# Altium schematic sheet OSC.SchDoc
size A3; SheetNumber: 1; SheetTotal: 1
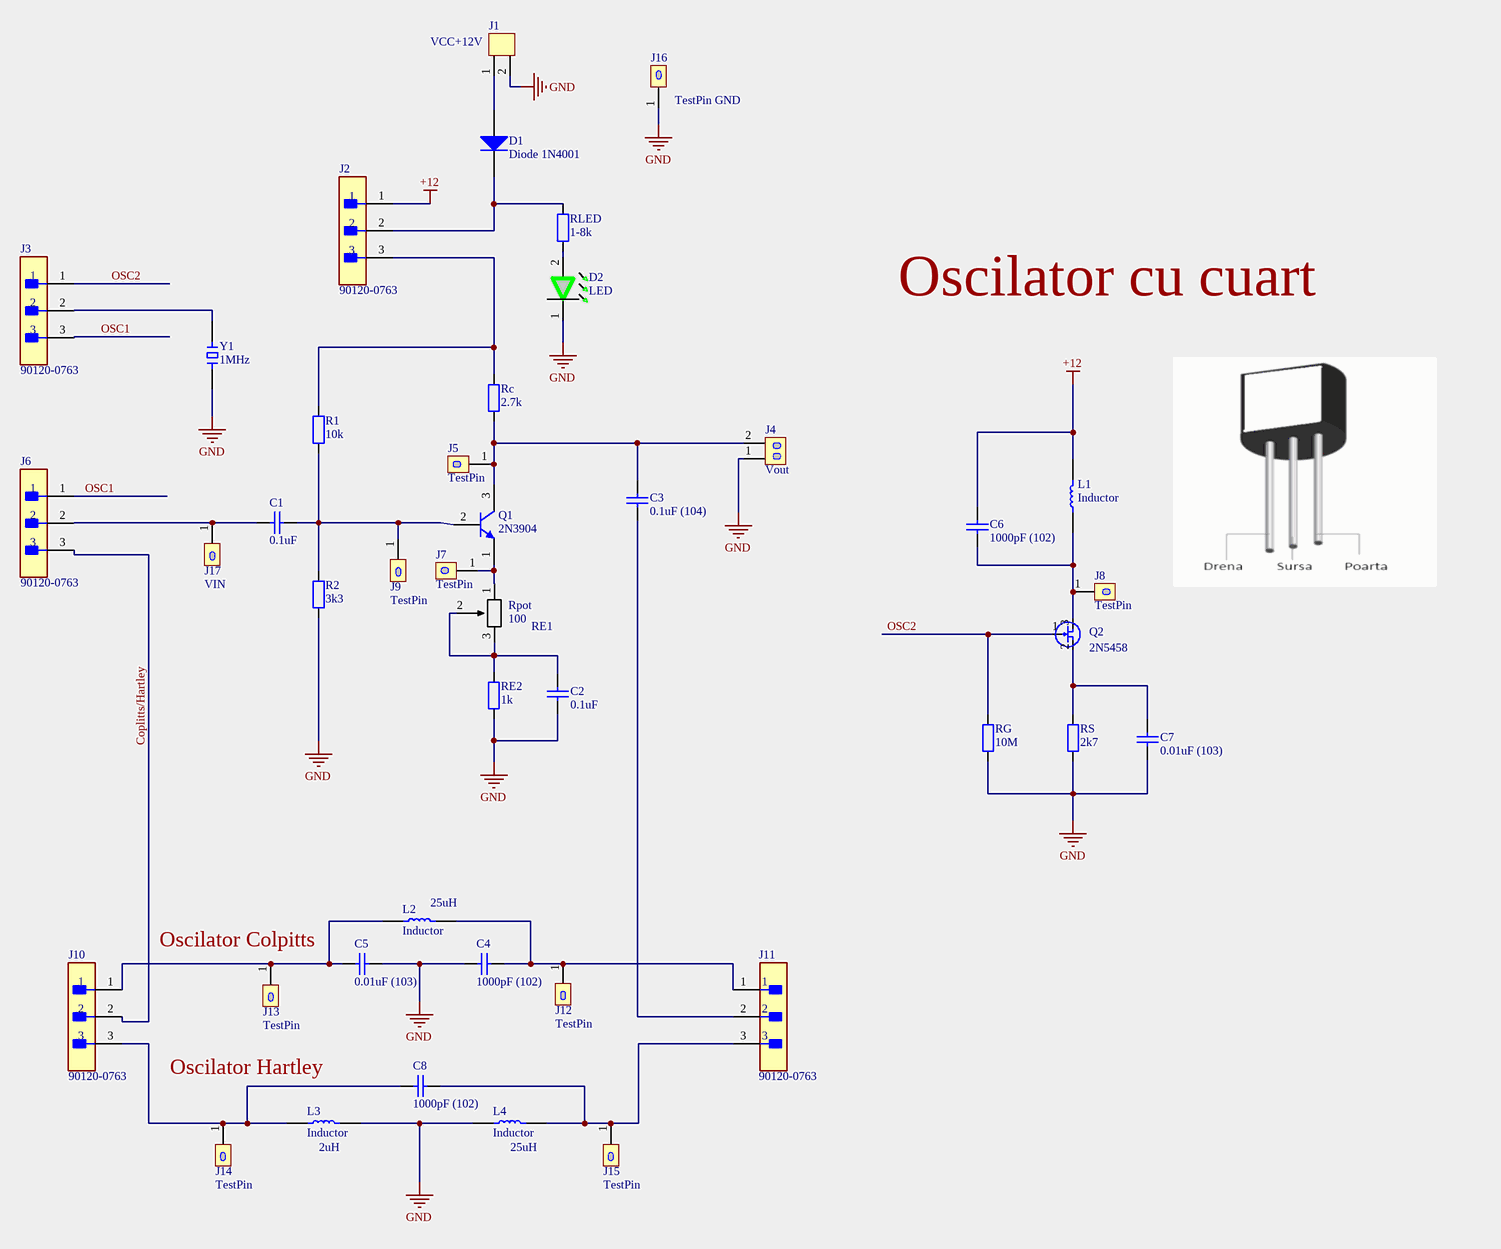
[diagram p0: OSC.SchDoc]

## Parts
C1  0.1uF  [CAP4.5mm]
C2  0.1uF  [CAP4.5mm]
C3  0.1uF (104)  [CAP4.5mm]
C4  1000pF (102)  [CAP4.5mm]
C5  0.01uF (103)  [CAP4.5mm]
C6  1000pF (102)  [CAP4.5mm]
C7  0.01uF (103)  [CAP4.5mm]
C8  1000pF (102)  [CAP4.5mm]
D1  Diode 1N4001  [DO-41]
D2  LED  [LED]
J1  VCC+12V  [HDR_1X2_TE]
J2  90120-0763  [FP-90120-0763-MFG]
J3  90120-0763  [FP-90120-0763-MFG]
J4  Vout  [HDR_1x2_pin]
J5  TestPin  [HDR_1x1_pin]
J6  90120-0763  [FP-90120-0763-MFG]
J7  TestPin  [HDR_1x1_pin]
J8  TestPin  [HDR_1x1_pin]
J9  TestPin  [HDR_1x1_pin]
J10  90120-0763  [FP-90120-0763-MFG]
J11  90120-0763  [FP-90120-0763-MFG]
J12  TestPin  [HDR_1x1_pin]
J13  TestPin  [HDR_1x1_pin]
J14  TestPin  [HDR_1x1_pin]
J15  TestPin  [HDR_1x1_pin]
J16  TestPin GND  [HDR_1x1_pin]
J17  VIN  [HDR_1x1_pin]
L1  Inductor  [Inductor1]
L2  Inductor  [Inductor1]
L3  Inductor  [Inductor1]
L4  Inductor  [Inductor1]
Q1  2N3904  [ONSC-TO-92-3-29-11]
Q2  2N5458  [2N5458]
R1  10k  [Resistor]
R2  3k3  [Resistor]
Rc  2.7k  [Resistor]
RE1  Rpot100ohm  [Potentiometer]  (value not drawn)
RE2  1k  [Resistor]
RG  10M  [Resistor]
RLED  1-8k  [Resistor]
RS  2k7  [Resistor]
Y1  1MHz  [XTAL]

## Nets
+12: C6.2 J2.1 L1.1
GND: C2.2 C4.1 C5.2 C7.1 D2.1 J1.2 J4.1 J16.1 L3.1 L4.2 R2.1 RE2.1 RG.1 RS.1 Y1.1
Coplitts/Hartley: J6.3 J10.2
OSC1: J3.3 J6.1
OSC2: J3.1 Q2.1 RG.2
NetC1_1: C1.1 J6.2 J17.1
NetC1_2: C1.2 J9.1 Q1.2(B) R1.1 R2.2
NetC2_1: C2.1 RE1.2 RE1.3 RE2.2
NetC3_1: C3.1 J4.2 J5.1 Q1.3(C) Rc.1
NetC3_2: C3.2 J11.2
NetC4_2: C4.2 J11.1 J12.1 L2.1
NetC5_1: C5.1 J10.1 J13.1 L2.2
NetC6_1: C6.1 J8.1 L1.2 Q2.3(D)
NetC7_2: C7.2 Q2.2(S) RS.2
NetC8_1: C8.1 J10.3 J14.1 L3.2
NetC8_2: C8.2 J11.3 J15.1 L4.1
NetD1_1: D1.1(A) J1.1
NetD1_2: D1.2(K) J2.2 RLED.2
NetD2_2: D2.2 RLED.1
NetJ2_3: J2.3 R1.2 Rc.2
NetJ3_2: J3.2 Y1.2
NetJ7_1: J7.1 Q1.1(E) RE1.1

## Notes on the sheet
- Oscilator cu cuart
- (near C5) Oscilator Colpitts
- (near L2) 25uH
- Oscilator Hartley
- (near L3) 2uH
- (near L4) 25uH
- (in symbol Rpot) 100

## Library data of the parts
C1-C8 = CAP 104: 104 cap
D1 = Diode 1N4001: 1 Amp General Purpose Rectifier; Published: 8-Jun-2000; LatestRevisionDate: 17-Jul-2002; LatestRevisionNote: Re-released for DXP Platform.; DatasheetVersion: 1998; PackageVersion: Aug-1999; PackageReference: DO-41; Publisher: Altium Limited; PackageDescription: Diode, Axial; Body 5.2 x 2.7 mm (LxDia. max), Lead Dia. 0.86 mm (max); Code_JEDEC: DO-204-AL; ComponentLink1Description: Manufacturer Link; ComponentLink1URL: http://www.fairchildsemi.com/; ComponentLink2Description: Datasheet; ComponentLink2URL: http://www.fairchildsemi.com/ds/1N%2F1N4001.pdf
J1 = CON_1x2: Connector, 2-Ports
J2 J3 J6 J10 J11 = CMP-04776-000084-1: CONN HEADER VERT 3POS 2.54MM; Manufacturer: Molex; Voltage Rating: 350V; Number Of Contacts: 3; Conn Orientation: Vertical; Current Rating: 3A; Conn Gender: Male; Package: 90120-0763; ComponentLink2Description: Datasheet; Height: 5.8mm; Manufacturer Part Number: 90120-0763; Temperature Range High: +125°C; RoHS: TRUE; ComponentLink2URL: https://www.molex.com/webdocs/datasheets/pdf/en-us/0901200763_PCB_HEADERS.pdf; Device Class L2: Headers and Wire Housings; Temperature: -55°C to +125°C; Device Class L1: Connectors; Pitch: 2.54mm; Footprint Url: https://www.molex.com/pdm_docs/sd/901200763_sd.pdf; Device Class L3: unset; Temperature Range Low: -55°C; Number Of Rows: 1; Category: Conn; Lead Free: Yes; Mouser Description: Board-To-Board Connector, C-Grid III 90120 Series, Through Hole, Header, 3, 2.54 mm; Octopart: https://octopart.com/90120-0763-molex-655433; Contact Material: Gold,Nickel; Automotive: No; Digikey Description: CONN HEADER VERT 3POS 2.54MM
J4 = HDR_1x2: Header, 2-Pin
J5 J7-J9 J12-J17 = Test Pin
Q1 = CMP-2000-05562-1: General Purpose Transistor, NPN Silicon, 200 mA, 60 V, -55 to 150 degC, 3-Pin TO-92, RoHS, Bulk; Manufacturer: ONSemiconductor; Emitter- Base Voltage VEBO: 6V; Maximum Power Dissipation: 625mW; Maximum DC Collector Current: 0.2A; Collector- Emitter Voltage VCEO Max: 40V; Collector- Base Voltage VCBO: 60V; DC Collector/Base Gain hfe Min: 60; Configuration: Single; Collector-Emitter Saturation Voltage: 0.3V; Gain Bandwidth Product fT: 270MHz; Mounting Style: ThroughHole; Package / Case: TO-92-3(TO-226); Mounting Technology: ThroughHole; Minimum Operating Temperature: -65C; Datasheet Version: Rev. 8, 08/2012; Product Category: BipolarTransistors-BJT; Factory Pack Quantity: 5000; Transistor Polarity: NPN; Package Description: 3-Pin Transistor Outline, Body 4.825 x 3.685 mm, Pitch 1.27 mm; RoHS: Details; Datasheet URL: https://datasheet.ciiva.com/4725/2n3903-d-285841-4725808.pdf; Packaging: Bulk; Maximum Operating Temperature: +150C; Package Reference: TO-92-3-29-11; Brand: ONSemiconductor; Manufacturer URL: http://www.onsemi.com/
Q2 = JFET N 2N5458
R1 R2 Rc RE2 RG RLED RS = Resistor 0.25W 5mm: 0.25W,Axial
RE1 = Rpot
Y1 = Xtal